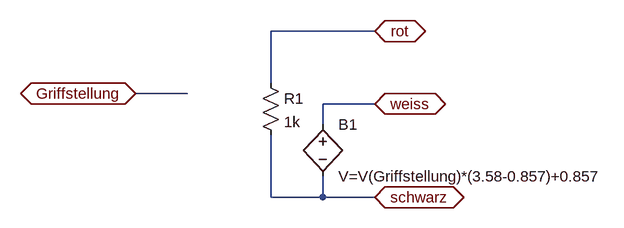
[diagram p0: schematic Drehgriff.asc]
Drehgriff.asc, the LTspice schematic file:
Version 4
SHEET 1 880 680
WIRE 384 -48 224 -48
WIRE 224 32 224 -48
WIRE 96 48 16 48
WIRE 384 64 304 64
WIRE 304 96 304 64
WIRE 224 208 224 112
WIRE 304 208 304 176
WIRE 304 208 224 208
WIRE 384 208 304 208
FLAG 16 48 Griffstellung
IOPIN 16 48 BiDir
FLAG 384 -48 rot
IOPIN 384 -48 BiDir
FLAG 384 208 schwarz
IOPIN 384 208 BiDir
FLAG 384 64 weiss
IOPIN 384 64 BiDir
SYMBOL bv 304 80 R0
SYMATTR InstName B1
SYMATTR Value V=V(Griffstellung)*(3.58-0.857)+0.857
SYMBOL res 208 16 R0
SYMATTR InstName R1
SYMATTR Value 1k

The netlist it stands for:
* Drehgriff.asc
B1 weiss schwarz V=V(Griffstellung)*(3.58-0.857)+0.857
R1 rot schwarz 1k
.backanno
.end